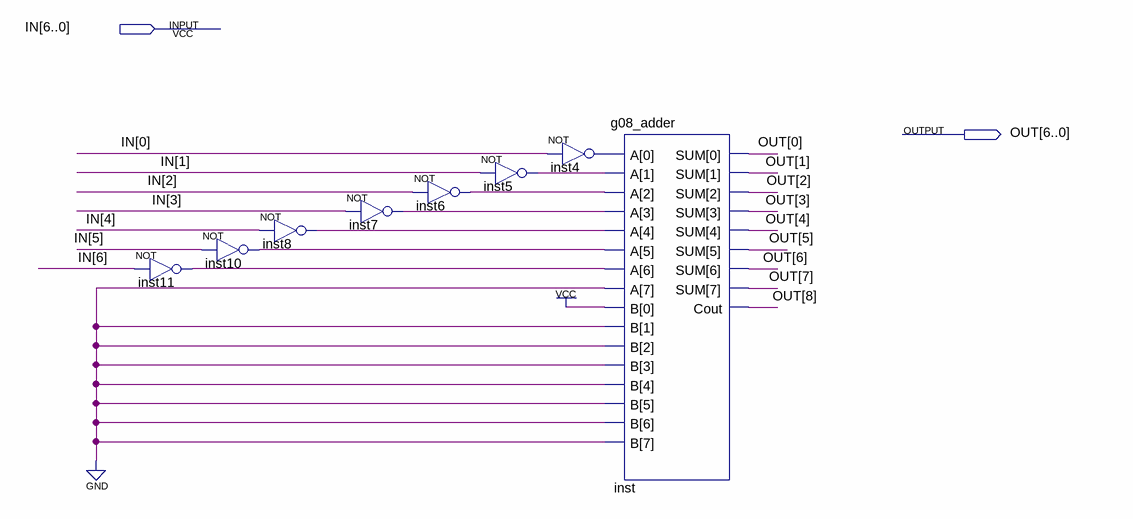
[diagram p0: schematic sheet]
// Quartus schematic 2C7BITS.bdf as structural Verilog: 8 symbols, 2 pins
module \2C7BITS  (
  input  [6:0] IN,
  output [8:0] OUT
);

  wire inst4_out, inst5_out, inst6_out, inst7_out, inst8_out, inst10_out, inst11_out;

  not inst11 (inst11_out, IN[6]);
  not inst8 (inst8_out, IN[4]);
  not inst10 (inst10_out, IN[5]);
  not inst7 (inst7_out, IN[3]);
  not inst6 (inst6_out, IN[2]);
  not inst5 (inst5_out, IN[1]);
  not inst4 (inst4_out, IN[0]);
  g08_adder inst (
    .A({1'b0, inst11_out, inst10_out, inst8_out, inst7_out, inst6_out, inst5_out, inst4_out}),
    .B(8'b00000001), .SUM(OUT[7:0]), .Cout(OUT[8]));
endmodule
